# EAGLE design leo_joy_gamer_v2 (EAGLE 6.3)
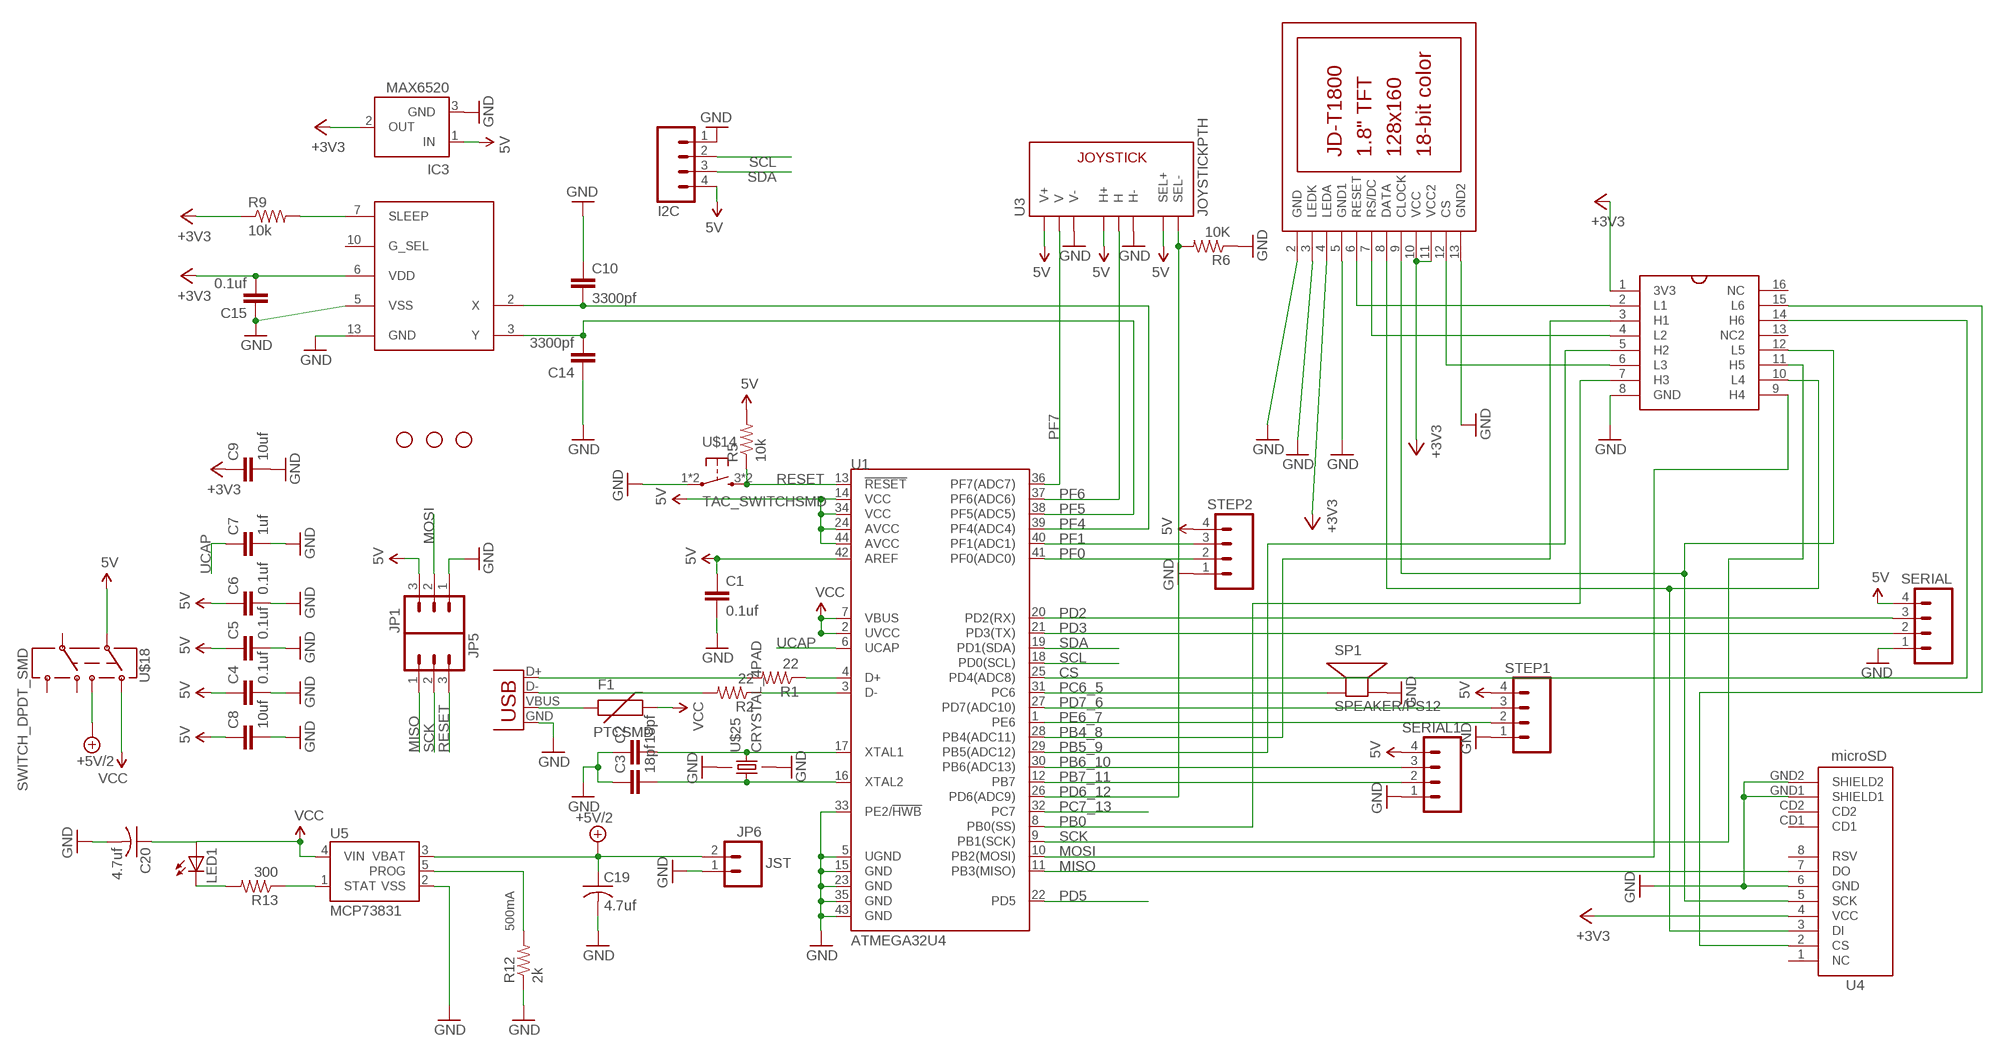
[diagram p0: schematic, sheet 1]

## Parts
C1  0.1uf  CAP0805  [0805]
C2  18pf  CAP0805  [0805]
C3  18pf  CAP0805  [0805]
C4  0.1uf  CAP0805  [0805]
C5  0.1uf  CAP0805  [0805]
C6  0.1uf  CAP0805  [0805]
C7  1uf  CAP0805  [0805]
C8  10uf  CAP0805  [0805]
C9  10uf  CAP0805  [0805]
C10  3300pf  CAP0805  [0805]
C14  3300pf  CAP0805  [0805]
C15  0.1uf  CAP0805  [0805]
C19  4.7uf  C-USC0603  [C0603]
C20  4.7uf  C-USC0603  [C0603]
F1  PTCSMD  [PTC-1206]
I2C  M04LOCK  [1X04_LOCK]
IC3  MAX6520  [SOT23]
JP1  M03LOCK  [1X03_LOCK]
JP2  STAND-OFF  [STAND-OFF]
JP3  STAND-OFF  [STAND-OFF]
JP4  STAND-OFF  [STAND-OFF]
JP5  M03LOCK  [1X03_LOCK]
JP6  JST  M02JST-PTH-2  [JST-2-PTH]
LCD1  JD-T1800  [JD-T1800]
LED1  LEDCHIPLED_1206  [CHIPLED_1206]
R1  22  R-US_M0805  [M0805]
R2  22  R-US_M0805  [M0805]
R5  10k  R-US_M0805  [M0805]
R6  10K  R-US_R0603  [R0603]
R9  10k  R-US_R0805  [R0805]
R12  2k  R-US_R0805  [R0805]
R13  300  R-US_R0805  [R0805]
SERIAL  M04LOCK  [1X04_LOCK]
SERIAL1  M04LOCK  [1X04_LOCK]
SP1  SPEAKER/PS12  [PS12]
STEP1  M04LOCK  [1X04_LOCK]
STEP2  M04LOCK  [1X04_LOCK]
U1  ATMEGA32U4  ATMEGA32U4QFN2  [QFN-44-NOPAD]
U3  JOYSTICKPTH  [JOYSTICK]
U4  microSD  USD-SOCKETSMD  [MICRO-SD-SOCKET-PP]
U5  MCP73831  [SOT23-5]
U$2  CD4050SO_16_MIDDLE  [SO_16]
U$12  ACCELEROMETER_MMA6331L  [LGA14]
U$14  TAC_SWITCHSMD  [TAC_SWITCH_SMD]
U$18  SWITCH_DPDT_SMD  [SWITCH_DPDT]
U$25  CRYSTAL_4PAD  [CRYSTAL_4PAD_TINY]
X1  USBSMD  [USB-MINIB]

## Nets
5V: C1.1 C4.1 C5.1 C6.1 C8.1 I2C.4 IC3.1(IN) JP1.3 R5.2 SERIAL1.4 SERIAL.4 STEP1.4 STEP2.4 U1.14(VCC) U1.24(AVCC) U1.34(VCC) U1.42(AREF) U1.44(AVCC) U3.B1A(SEL+) U3.H1(H+) U3.V1(V+) U$18.7
+3V3: C9.1 C15.2 IC3.2(OUT) LCD1.4(LEDA) LCD1.10(VCC) LCD1.11(VCC2) R9.1 U4.4(VCC) U$2.1(3V3) U$12.6(VDD)
+5V/2: C19.1 JP6.2 U5.3(VBAT) U$18.8
CS: U1.25(PD4(ADC8)) U$2.14(H6)
D+: R1.2 X1.D+
D-: R2.2 X1.D-
GND: C1.2 C2.1 C3.1 C4.2 C5.2 C6.2 C7.2 C8.2 C9.2 C10.1 C14.1 C15.1 C19.2 C20.2 I2C.1 IC3.3(GND) JP1.1 JP6.1 LCD1.2(GND) LCD1.3(LEDK) LCD1.5(GND1) LCD1.13(GND2) R6.1 R12.1 SERIAL1.1 SERIAL.1 SP1.P$2(-) STEP1.1 STEP2.1 U1.5(UGND) U1.15(GND) U1.23(GND) U1.33(PE2/!HWB) U1.35(GND) U1.43(GND) U3.H3(H-) U3.V3(V-) U4.6(GND) U4.GND1(SHIELD1) U4.GND2(SHIELD2) U5.2(VSS) U$2.8(GND) U$12.5(VSS) U$12.13(GND) U$14.1 U$14.2 U$25.2(GND2) U$25.4(GND4) X1.GND
MISO: JP5.1 U1.11(PB3(MISO)) U4.7(DO)
MOSI: JP1.2 U1.10(PB2(MOSI)) U$2.9(H4)
MOSI_3V3: LCD1.8(DATA) U4.3(DI) U$2.10(L4)
N$1: LCD1.6(RESET) U$2.2(L1)
N$2: C2.2 U1.17(XTAL1) U$25.3
N$3: C3.2 U1.16(XTAL2) U$25.1
N$4: LCD1.7(RS/DC) U$2.4(L2)
N$5: LCD1.12(CS) U$2.6(L3)
N$6: R1.1 U1.4(D+)
N$7: U4.2(CS) U$2.15(L6)
N$8: R2.1 U1.3(D-)
N$10: R9.2 U$12.7(SLEEP)
N$13: R13.1 U5.1(STAT)
N$14: LED1.C R13.2
PB0: U1.8(PB0(SS)) U$2.7(H3)
PB4_8: U1.28(PB4(ADC11)) U$2.3(H1)
PB5_9: U1.29(PB5(ADC12)) U$2.5(H2)
PB6_10: SERIAL1.3 U1.30(PB6(ADC13))
PB7_11: SERIAL1.2 U1.12(PB7)
PC6_5: SP1.P$1(+) U1.31(PC6)
PC7_13: U1.32(PC7)
PD2: SERIAL.3 U1.20(PD2(RX))
PD3: SERIAL.2 U1.21(PD3(TX))
PD5: U1.22(PD5)
PD6_12: R6.2 U1.26(PD6(ADC9)) U3.B2A(SEL-)
PD7_6: STEP1.3 U1.27(PD7(ADC10))
PE6_7: STEP1.2 U1.1(PE6)
PF0: STEP2.2 U1.41(PF0(ADC0))
PF1: STEP2.3 U1.40(PF1(ADC1))
PF4: C10.2 U1.39(PF4(ADC4)) U$12.2(X)
PF5: C14.2 U1.38(PF5(ADC5)) U$12.3(Y)
PF6: U1.37(PF6(ADC6)) U3.H2(H)
PF7: U1.36(PF7(ADC7)) U3.V2(V)
PROG: R12.2 U5.5(PROG)
RESET: JP5.3 R5.1 U1.13(!RESET) U$14.3 U$14.4
SCK: JP5.2 U1.9(PB1(SCK)) U$2.11(H5)
SCK_3V3: LCD1.9(CLOCK) U4.5(SCK) U$2.12(L5)
SCL: I2C.2 U1.18(PD0(SCL))
SDA: I2C.3 U1.19(PD1(SDA))
UCAP: C7.1 U1.6(UCAP)
VBUS: F1.1 X1.VBUS
VCC: C20.1 F1.2 LED1.A U1.2(UVCC) U1.7(VBUS) U5.4(VIN) U$18.1
Unconnected: U4.1(NC) U4.8(RSV) U4.CD1 U4.CD2 U$2.13(NC2) U$2.16(NC) U$12.10(G_SEL) U$18.9 U$18.10 U$18.11

## Notes on the sheet
- 500mA

## Library data of the parts
C1-C10 C14 C15 = SparkFun:CAP: Capacitor Standard 0603 ceramic capacitor, and 0.1" leaded capacitor.
C19 C20 = resistor:C-US: CAPACITOR, American symbol
F1 = SparkFun:PTC: Resettable Fuse PTC Resettable Fuse. Spark Fun Electronics SKU : COM-08357
I2C SERIAL SERIAL1 STEP1 STEP2 = SparkFun:M04: Header 4 Standard 4-pin 0.1" header. Use with straight break away headers (SKU : PRT-00116), right angle break away headers (PRT-00553), swiss pins (PRT-00743), machine pins (PRT-00117), and female headers (PRT-00115). Molex polarized connector foot print use with SKU : PRT-08231 with associated crimp pins and housings. 1MM SMD Version SKU: PRT-10208
IC3 = maxim:MAX6520: 1.2V Voltage Reference 50ppm/°C, SOT23, 3-Terminal Source: http://datasheets.maxim-ic.com/en/ds/MAX6520.pdf
JP1 JP5 = SparkFun:M03: Header 3 Standard 3-pin 0.1" header. Use with straight break away headers (SKU : PRT-00116), right angle break away headers (PRT-00553), swiss pins (PRT-00743), machine pins (PRT-00117), and female headers (PRT-00115). Molex polarized connector foot print use with SKU : PRT-08232 with associated crimp pins and housings.
JP2-JP4 = SparkFun:STAND-OFF: Stand Off This is the mechanical footprint for a #4 phillips button head screw. Use the keepout ring to avoid running the screw head into surrounding components. SKU : PRT-00447
JP6 = SparkFun:M02: Header 2 Standard 2-pin 0.1" header. Use with straight break away headers (SKU : PRT-00116), right angle break away headers (PRT-00553), swiss pins (PRT-00743), machine pins (PRT-00117), and female headers (PRT-00115). Molex polarized connector foot print use with SKU : PRT-08233 with associated crimp pins and housings.
LCD1 = adafruit:JD-T1800
LED1 = adafruit:LED: LED OSRAM: - CHIPLED LG R971, LG N971, LY N971, LG Q971, LY Q971, LO R971, LY R971 LH N974, LH R974 LS Q976, LO Q976, LY Q976 LO Q996 - Hyper CHIPLED LW Q18S LB Q993, LB Q99A, LB R99A - SideLED LS A670, LO A670, LY A670, LG A670, LP A670 LB A673, LV A673, LT A673, LW A673 LH A674 LY A675 LS A676, LA A676, LO A676, LY A676, LW A676 LS A679, LY A679, LG A679 - Hyper Micro SIDELED® LS Y876, LA Y876, LO Y876, LY Y876 LT Y87S - SmartLED LW L88C, LW L88S LB L89C, LB L89S, LG L890 LS L89K, LO L89K, LY L89K LS L896, LA L896, LO L896, LY L896 - TOPLED LS T670, LO T670, LY T670, LG T670, LP T670 LSG T670, LSP T670, LSY T670, LOP T670, LYG T670 LG T671, LOG T671, LSG T671 LB T673, LV T673, LT T673, LW T673 LH T674 LS T676, LA T676, LO T676, LY T676, LB T676, LH T676, LSB T676, LW T676 LB T67C, LV T67C, LT T67C, LS T67K, LO T67K, LY T67K, LW E67C LS E67B, LA E67B, LO E67B, LY E67B, LB E67C, LV E67C, LT E67C LW T67C LS T679, LY T679, LG T679 LS T770, LO T770, LY T770, LG T770, LP T770 LB T773, LV T773, LT T773, LW T773 LH T774 LS E675, LA E675, LY E675, LS T675 LS T776, LA T776, LO T776, LY T776, LB T776 LHGB T686 LT T68C, LB T68C - Hyper Mini TOPLED® LB M676 - Mini TOPLED Santana® LG M470 LS M47K, LO M47K, LY M47K Source: http://www.osram.convergy.de/
R1 R2 R5 R6 R9 R12 R13 = resistor:R-US_: RESISTOR, American symbol
SP1 = adafruit:SPEAKER: SPEAKER Source: Buerklin Added PS12 (for part # PS1240 piezo) http://www.ladyada.net/library/pcb/eaglelibrary.html
U1 = SparkFun:ATMEGA32U4
U3 = SparkFun:JOYSTICK: Thumb Joystick Joystick commonly found in PS2 controllers. Two pots and a select switch. Footprint proven. Spark Fun Electronics SKU : COM-09032
U4 = SparkFun:USD-SOCKET: microSD Socket Push-push type uSD socket. Schematic element and footprint production proven. Spark Fun Electronics SKU : PRT-00127. tDoc lines correctly indicate media card edge positions when inserting (unlocked, locked, depressed).
U5 = SparkFun:MCP73831: Microchip's MCP73831 Miniature single cell, fully integrated Li-Ion, Li-polymer charge management controller http://ww1.microchip.com/downloads/en/DeviceDoc/21984a.pdf
U$2 = sam:CD4050
U$12 = sam:ACCELEROMETER_MMA6331L
U$14 = sam:TAC_SWITCH
U$18 = sam:SWITCH_DPDT_SMD
U$25 = sam:CRYSTAL_4PAD
X1 = SparkFun:USB: USB Connectors USB-B-PTH is fully proven SKU : PRT-00139 USB-miniB is fully proven SKU : PRT-00587 USB-A-PCB is untested. USB-A-H is throughly reviewed, but untested. Spark Fun Electronics SKU : PRT-00437 USB-B-SMT is throughly reviewed, but untested. Needs silkscreen touching up. USB-A-S has not been used/tested USB-MB-H has not been used/tested

## Board
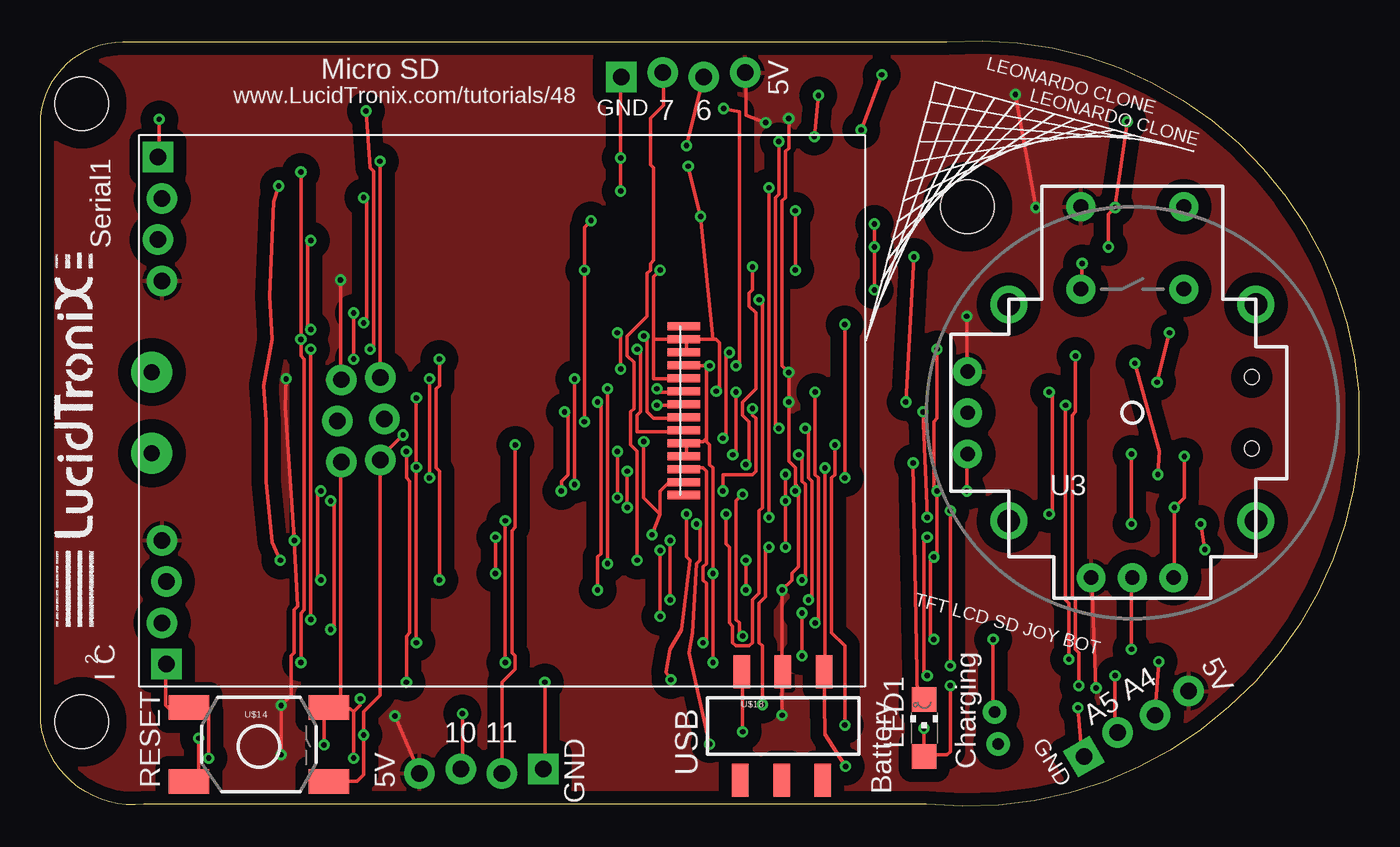
[diagram p1: board, top side]
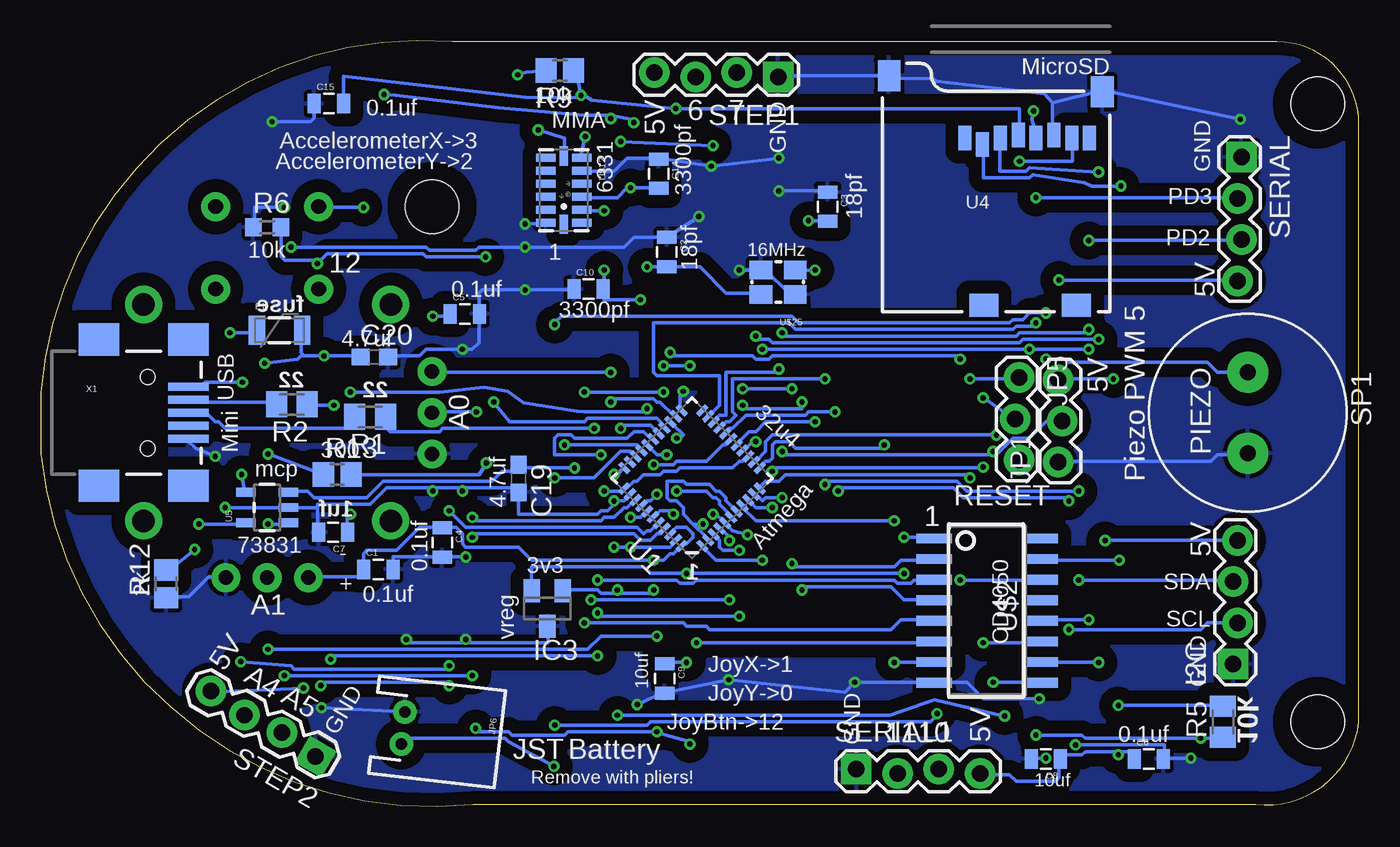
[diagram p2: board, bottom side, seen from below]

Size 81.28 x 47.2 mm. Coordinates in mm from the lower left corner, seen from the top.
Outline: 6.35,0.13 arc-90 0,5.21 0,42.04 arc-90 5.08,47.12 55.88,47.12 arc-90 81.28,25.53 81.28,21.72 arc-90 54.61,0.13 6.35,0.13
Copper layers (1*16): Top 0.0356mm / dielectric 1.5011mm / Bottom 0.0356mm
Design rules "LaenPCBOrder *": minimum track width 8mil, minimum drill 13mil, track to track 6mil, track to pad 6mil, pad to pad 6mil, via to via 6mil, smd to smd 6mil, copper to edge 15mil, drill to drill 6mil, minimum pad ring 7mil, minimum via ring 7mil, stop-mask expansion 4mil, vias tented up to drill 26mil, thermal gap 10mil

### Footprints (pad centres in the part's own frame; a part is rotated, then mirrored left to right if it is on the bottom)
0805 = smd 0.8 x 1.2: 1 -0.9,0; 2 0.9,0
C0603 = smd 1.1 x 1: 1 -0.85,0; 2 0.85,0
PTC-1206 = smd 1 x 1.8: 1 -1.4,0; 2 1.4,0
1X04_LOCK = drill 1.016 pad 1.88 square: 1 0,0.127 | drill 1.016 pad 1.88: 2 2.54,-0.127; 3 5.08,0.127; 4 7.62,-0.127
SOT23 = smd 1 x 1.4: 1 -0.95,-1.1; 2 0.95,-1.1; 3 0,1.1
1X03_LOCK = drill 1.016 pad 1.88: 1 0,0.127; 2 2.54,-0.127; 3 5.08,0.127
STAND-OFF = hole 3.302: 0,0
JST-2-PTH = drill 0.7 pad 1.448: 1 -1,0; 2 1,0
JD-T1800 = smd 0.5 x 2: 1 5.2,-13.1; 2 4.4,-13.1; 3 3.6,-13.1; 4 2.8,-13.1; 5 2,-13.1; 6 1.2,-13.1; 7 0.4,-13.1; 8 -0.4,-13.1; 9 -1.2,-13.1; 10 -2,-13.1; 11 -2.8,-13.1; 12 -3.6,-13.1; 13 -4.4,-13.1; 14 -5.2,-13.1
CHIPLED_1206 = smd 1.5 x 1.5: A 0,-1.75; C 0,1.75
M0805 = smd 1.3 x 1.6: 1 -0.95,0; 2 0.95,0
R0603 = smd 1 x 1.1: 1 -0.85,0; 2 0.85,0
R0805 = smd 1.3 x 1.5: 1 -0.85,0; 2 0.85,0
PS12 = drill 1 pad 2.54: P$1 -2.5,0; P$2 2.5,0
QFN-44-NOPAD = smd 0.8 x 0.3: 1 -3.4,2.5; 2 -3.4,2; 3 -3.4,1.5; 4 -3.4,1; 5 -3.4,0.5; 6 -3.4,0; 7 -3.4,-0.5; 8 -3.4,-1; 9 -3.4,-1.5; 10 -3.4,-2; 11 -3.4,-2.5; 23 3.4,-2.5; 24 3.4,-2; 25 3.4,-1.5; 26 3.4,-1; 27 3.4,-0.5; 28 3.4,0; 29 3.4,0.5; 30 3.4,1; 31 3.4,1.5; 32 3.4,2; 33 3.4,2.5 | smd 0.3 x 0.8: 12 -2.5,-3.4; 13 -2,-3.4; 14 -1.5,-3.4; 15 -1,-3.4; 16 -0.5,-3.4; 17 0,-3.4; 18 0.5,-3.4; 19 1,-3.4; 20 1.5,-3.4; 21 2,-3.4; 22 2.5,-3.4; 34 2.5,3.4; 35 2,3.4; 36 1.5,3.4; 37 1,3.4; 38 0.5,3.4; 39 0,3.4; 40 -0.5,3.4; 41 -1,3.4; 42 -1.5,3.4; 43 -2,3.4; 44 -2.5,3.4
JOYSTICK = drill 0.9 pad 1.778: B1A -3.175,12.7; B1B 3.175,12.7; B2A -3.175,7.62; B2B 3.175,7.62 | drill 0.889 pad 1.778: H1 -2.54,-10.16; H2 0,-10.16; H3 2.54,-10.16; V1 -10.16,2.54; V2 -10.16,0; V3 -10.16,-2.54 | drill 1.397 pad 2.286: MOUNT1 -7.62,6.668; MOUNT2 -7.62,-6.668; MOUNT3 7.62,-6.668; MOUNT4 7.62,6.668
MICRO-SD-SOCKET-PP = smd 0.8 x 1.5: 1 -8.94,10.7; 2 -7.84,10.3; 3 -6.74,10.7; 4 -5.64,10.9; 5 -4.54,10.7; 6 -3.44,10.9; 7 -2.34,10.7; 8 -1.24,10.7 | smd 1.8 x 1.4: CD1 -7.75,0.4; CD2 -2.05,0.4 | smd 1.4 x 1.9: GND1 -13.6,14.55; GND2 -0.45,13.55
SOT23-5 = smd 0.55 x 1.2: 1 -0.95,-1.3; 2 0,-1.3; 3 0.95,-1.3; 4 0.95,1.3; 5 -0.95,1.3
SO_16 = smd 0.6 x 2.2: 1 -4.445,-3.457; 2 -3.175,-3.457; 3 -1.905,-3.457; 4 -0.635,-3.457; 5 0.635,-3.457; 6 1.905,-3.457; 7 3.175,-3.457; 8 4.445,-3.457; 9 4.445,3.076; 10 3.175,3.076; 11 1.905,3.076; 12 0.635,3.076; 13 -0.635,3.076; 14 -1.905,3.076; 15 -3.175,3.076; 16 -4.445,3.076
LGA14 = smd 0.5 x 1.2: 1 2,1.1; 2 1.2,1.1; 3 0.4,1.1; 4 -0.4,1.1; 5 -1.2,1.1; 6 -2,1.1; 8 -2,-1.1; 9 -1.2,-1.1; 10 -0.4,-1.1; 11 0.4,-1.1; 12 1.2,-1.1; 13 2,-1.1 | smd 1.2 x 0.5: 7 -2.1,0; 14 2.1,0
TAC_SWITCH_SMD = smd 2.5 x 1.5: 1 -4.302,2.397; 2 4.302,2.397; 3 -4.302,-2.143; 4 4.302,-2.143
SWITCH_DPDT = smd 1.016 x 2.032: 1 -2.5,3.333; 7 0.04,3.333; 8 2.58,3.333; 9 -2.58,-3.333; 10 -0.04,-3.333; 11 2.5,-3.333
CRYSTAL_4PAD_TINY = smd 1.4 x 1.15: 1 0.724,0.602; 2 2.824,0.602; 3 2.824,2.102; 4 0.724,2.102
USB-MINIB = smd 2.5 x 0.5: D+ 2.5,0; D- 2.5,0.8; GND 2.5,-1.6; ID 2.5,-0.8; VBUS 2.5,1.6 | smd 2.5 x 2: MTN1 -3,4.5; MTN2 2.5,4.5; MTN3 -3,-4.5; MTN4 2.5,-4.5 | hole 0.9: 0,2.2; 0,-2.2

### Placement (x,y rotation side)
C1  60.45,14.61 0 bottom
C2  42.67,34.17 270 bottom
C3  32.77,36.96 270 bottom
C4  56.52,16.26 270 bottom
C5  55.12,30.36 0 bottom
C6  12.95,2.93 0 bottom
C7  63.25,16.9 180 bottom
C8  19.3,2.93 180 bottom
C9  42.8,7.88 270 bottom
C10  47.5,31.88 0 bottom
C14  43.18,38.99 270 bottom
C15  63.5,43.31 0 bottom
C19  51.82,20.2 270 bottom
C20  60.71,27.69 0 bottom
F1  66.55,29.34 0 bottom
I2C  7.62,8.77 90 bottom
IC3  50.04,12.2 180 bottom
JP1  18.41,21.21 90 bottom
JP2  2.54,5.21 0 top
JP3  57.15,36.96 0 top
JP4  2.54,43.31 0 top
JP5  21.08,26.42 270 bottom
JP6  58.93,4.83 263.4 bottom
LCD1  26.54,24.39 90 top
LED1  54.48,4.83 0 top
R1  60.96,24.01 180 bottom
R2  65.79,24.77 180 bottom
R5  8.38,5.21 90 bottom
R6  67.31,35.69 0 bottom
R9  49.28,45.34 180 bottom
R12  73.53,13.72 90 bottom
R13  62.99,20.45 0 bottom
SERIAL  7.37,40.01 270 bottom
SERIAL1  30.99,2.16 0 bottom
SP1  6.86,24.26 270 bottom
STEP1  35.81,45.09 180 bottom
STEP2  64.26,3.18 149.9 bottom
U1  41.12,20.23 135 bottom
U3  67.31,24.26 0 top
U4  15.37,30.48 0 bottom
U5  67.31,18.42 90 bottom
U$2  22.73,12.07 270 bottom
U$6  [LUCIDTRONIX_LOGO_.75_INCH]  3.81,10.55 90 top
U$12  49.02,37.98 270 bottom
U$14  13.46,3.69 0 top
U$18  45.72,4.96 0 top
U$25  34.04,33.66 180 bottom
X1  74.68,24.26 0 bottom

### Tracks (layer width: path | path; a pad name or v marks a point on that pad's centre or on a via)
5V  (via drill 0.33)
  Top 0.203: v14.83,3.18 v14.83,6.23 15.44,6.84 15.44,9.28 15.65,9.48 15.65,12.12 15.85,12.32 15.6,17 | v15.65,16.39 15.65,16.79 15.6,17 | 15.6,17 15.09,24.62 v15.14,26.34 | v18.49,32.44 18.49,26.34 JP1.3 | v44.7,42.14 43.48,42.6 43.48,45.04 STEP1.4 | v61.37,36.91 v60.1,43.87 | v65.08,7.29 64.82,13.95 U3.H1 | v43.48,13.34 v43.48,15.17 | v57.1,30.21 57.1,26.95 U3.V1 | v46.53,19.44 46.53,19.84 | 46.53,19.84 46.53,20.86 46.13,21.26 v46.13,24.92 v46.13,26.75 45.72,27.16 45.72,37.32 45.92,37.52 45.92,40.37 46.13,40.57 v46.13,42.4 | 46.53,19.84 46.74,19.64 46.74,14.76 46.33,14.36 46.33,13.95 v45.72,13.34 45.72,8.46 U$18.7 45.72,8.26 v45.72,5.62 | v21.84,5.57 SERIAL1.4
  Bottom 0.203: 14.83,3.38 16.87,3.38 17.07,3.18 18.49,3.18 18.49,2.98 C8.1 18.49,2.77 18.49,1.76 18.69,1.55 21.13,1.55 21.54,1.96 23.37,1.96 SERIAL1.4 | 14.83,3.38 13.82,3.38 13.82,2.98 C6.1 | v14.83,6.23 8.53,6.23 R5.2 | 14.83,3.38 v14.83,3.18 | v15.65,16.39 I2C.4 | v15.14,26.34 18.49,26.34 JP1.3 | v18.49,32.44 7.52,32.44 SERIAL.4 | v44.7,42.14 44.91,42.35 46.13,42.6 | 46.13,42.6 47.75,42.6 53.03,43.06 59.38,43.82 v60.1,43.87 | v61.37,36.91 64.01,36.91 U3.B1A | U3.H1 64.62,14.15 61.37,14.15 61.37,14.56 C1.1 61.37,14.76 61.37,15.57 61.16,15.78 59.33,15.78 57.91,17.2 56.69,17.2 C4.1 56.49,17.2 55.68,17.2 55.27,16.79 55.27,16.18 55.07,15.98 51.82,15.98 51,15.17 v43.48,15.17 42.88,15.17 42.47,15.57 42.27,15.57 41.86,15.98 U1.44 41.66,16.18 41.45,16.18 41.05,16.59 41.05,16.79 41.45,17.2 42.06,17.2 42.47,16.79 U1.42 | v65.08,7.29 70.71,7.04 STEP2.4 | v43.48,13.34 43.69,13.14 45.72,13.14 | 45.72,13.14 46.74,13.14 46.94,13.34 48.97,13.34 IC3.1 | 45.72,13.14 v45.72,13.34 | v57.1,30.21 56.08,30.21 C5.1 | U1.14 37.8,21.47 38,21.26 38.2,21.26 38.61,20.86 41.86,20.86 42.06,20.65 42.88,20.65 43.08,20.45 44.09,20.45 44.5,20.05 44.7,20.05 45.11,19.64 U1.34 45.31,19.44 v46.53,19.44 | v46.13,24.92 45.92,25.13 43.48,25.13 43.28,24.92 43.08,24.92 42.27,24.11 U1.24 | v46.13,26.75 57.1,26.75 U3.V1 | v46.13,42.4 46.13,42.6 | v21.84,5.57 26.16,6.58 28.91,5.62 v45.72,5.62
  pour Top (isolate 0.813): -6.86,-9.27 0,55.5 86.61,54.49 79.76,-9.27
+3V3  (via drill 0.33)
  Top 0.203: LCD1.11 39.83,21.67 39.83,22.28 LCD1.10 39.83,22.48 40.84,22.48 41.05,22.69 | 41.05,27.16 39.83,27.16 LCD1.4 | 41.05,22.69 41.05,27.16 | v41.45,8.87 v41.45,14.36 41.45,20.86 41.25,21.06 41.25,22.28 41.05,22.48 41.05,22.69 | v28.04,14.36 v28.04,16.59 | v47.95,43.82 v47.7,41.28 | v41.25,27.16 41.05,27.16 | v42.88,27.16 43.08,27.36 43.08,42.8 v42.11,43.01
  Bottom 0.203: v41.45,8.87 42.67,8.87 C9.1 | IC3.2 51,13.34 51,14.76 44.09,14.76 43.69,14.36 v41.45,14.36 v28.04,14.36 | v28.04,16.59 26.21,16.59 U$2.1 | v47.7,41.28 47.95,40.16 U$12.6 | R9.1 48.21,44.99 v47.95,43.82 47.95,43.62 48.16,43.67 | 48.16,43.67 51.41,43.72 62.59,44.99 C15.2 | 48.16,43.67 47.95,43.92 47.3,43.51 v42.11,43.01 20.93,43.01 20.93,41.58 U4.4 | v42.88,27.16 v41.25,27.16
+5V/2  (via drill 0.33)
  Top 0.203: v48.36,20.86 48.36,8.46 U$18.8 48.36,4.45 v49.63,2.47
  Bottom 0.203: v48.36,20.86 51.61,20.86 | 51.61,20.86 51.82,20.86 C19.1 51.61,20.86 | 51.61,20.86 51.82,20.65 52.83,20.65 53.44,20.05 60.15,20.05 61.16,19.03 64.41,19.03 64.82,19.44 65.84,19.44 U5.3 | v49.63,2.47 52.43,3.99 52.63,4.2 58.73,4.2 58.93,3.99 JP6.2
CS  (via drill 0.33)
  Top 0.203: v42.06,22.69 42.27,22.89 42.27,27.77 v42.47,27.97 | v24.59,27.56 24.59,25.94 24.38,25.73 24.38,20.86 24.59,20.65 v24.59,13.95
  Bottom 0.203: v42.06,22.69 41.86,22.69 41.66,22.89 42.27,23.5 U1.25 | v42.47,27.97 42.27,27.77 37.39,27.77 37.19,27.56 36.37,27.56 36.17,27.77 24.79,27.77 v24.59,27.56 | v24.59,13.95 19.71,13.95 U$2.14
D+
  Bottom 0.203: R1.2 61.98,23.91 61.98,23.3 69.9,23.3 70.31,23.7 70.51,23.7 71.12,24.31 72.14,24.31 X1.D+
D-
  Bottom 0.203: R2.2 66.85,24.92 72.14,24.92 X1.D-
GND  (via drill 0.33)
  Top 0.203: v67,42.19 v66.24,36.91 65.84,36.5 v65.84,34.47 | v51.41,31.83 v51.41,34.47 v51.41,35.89 | v41.66,25.58 41.86,25.53 41.86,28.58 41.66,28.78 41.45,28.78 | 39.83,28.78 41.45,28.78 | 41.45,28.78 v40.69,36.35 v39.93,39.45 | 37.8,28.78 37.8,26.34 39.62,26.34 LCD1.5 | 37.8,28.78 39.62,28.78 LCD1.2 39.83,28.78 | 39.83,28.78 39.83,28.17 LCD1.3 | v38.2,33.05 37.8,32.64 37.8,28.78 | v35.76,37.93 v35.76,39.96 35.76,44.84 STEP1.1 | v7.32,42.35 7.32,40.16 SERIAL.1 | v55.07,10.29 54.86,10.49 54.86,15.17 v55.07,15.37 55.27,15.57 v55.27,19.44 55.07,19.64 55.07,23.7 55.27,23.91 v55.27,28.17 | v58.73,10.29 58.73,6.02 JP6.1 | v63.96,6.08 64.21,3.18 STEP2.1 | 19.3,5.82 v19.3,2.98 | 19.3,5.82 19.1,6.02 18.49,6.02 | 18.49,6.02 17.88,6.02 U$14.2 | v10.36,2.98 10.36,5.82 10.16,6.02 9.35,6.02 U$14.1 9.14,6.02 7.92,6.02 7.72,6.23 7.72,8.67 I2C.1 | v17.48,3.79 17.48,6.02 17.68,6.02 U$14.2 | U3.H3 69.9,14.15 v69.9,18.42 70.51,19.03 v70.51,21.57 | v31.09,7.65 31.09,2.37 SERIAL1.1 | v57.1,19.44 57.1,21.67 U3.V3 | 38.2,18.01 38.2,19.44 38.81,20.05 39.62,20.05 LCD1.13 | 38.2,18.01 v37.69,16.74 | v37.19,22.48 37.19,19.03 38.2,18.01 | v45.92,15.98 v45.92,18.83 v45.92,20.45 | v44.5,6.28 44.5,9.89 44.3,10.09 44.3,12.53 44.7,12.93 44.7,15.78 v44.91,15.98 | v39.83,18.01 39.83,15.37 40.03,15.17 39.52,10.9 38.81,9.68 38.56,8.26 v38.86,7.8 | 19.3,5.82 19.71,6.23 v19.71,6.63 | 18.49,6.02 18.49,21.06 JP1.1 | 18.49,6.02 U$14.2
  Bottom 0.203: v66.24,36.91 68.07,36.91 68.07,35.69 R6.1 | v67,42.19 64.62,42.19 64.41,42.4 64.41,43.21 C15.1 | C20.2 59.74,27.77 57.91,27.77 57.51,28.17 v55.27,28.17 54.66,28.17 54.25,28.58 54.25,30.21 C5.2 54.25,30.41 54.25,31.63 54.05,31.83 v51.41,31.83 48.56,31.83 C10.1 | v51.41,35.89 50.19,35.89 U$12.13 | v65.84,34.47 57.51,34.47 57.3,34.27 54.46,34.27 54.25,34.47 v51.41,34.47 45.31,34.47 44.7,35.08 C2.1 | U$12.5 47.75,39.15 45.92,39.15 45.11,39.96 43.28,39.96 C14.1 43.08,39.96 v39.93,39.45 v35.76,39.96 | U$25.4 34.95,31.63 35.15,31.63 36.58,33.05 36.78,33.05 U$25.2 36.98,33.05 v38.2,33.05 | v41.66,25.58 41.86,25.33 41.86,24.52 U1.23 | v40.69,36.35 C2.1 | 18.9,43.36 18.9,41.58 U4.6 | 15.8,44.12 18.9,43.36 | 15.8,44.12 15.85,44.07 15.85,44.02 U4.GND2 | v35.76,37.93 32.92,37.93 C3.1 | STEP1.1 35.76,45.04 29.06,45.04 U4.GND1 29.06,44.84 26.26,44.89 26.06,44.68 19.41,43.92 18.9,43.36 | 15.8,44.12 v7.32,42.35 | C2.1 | 49.99,11.1 IC3.3 49.99,10.9 49.99,10.09 54.86,10.09 | C1.2 59.54,14.76 59.54,15.37 56.69,15.37 C4.2 56.49,15.37 v55.07,15.37 | v58.73,10.29 58.52,10.09 54.86,10.09 | 54.86,10.09 v55.07,10.29 | v63.96,6.08 58.93,5.82 JP6.1 | JP1.1 18.49,21.26 9.14,21.26 8.74,21.67 6.91,21.67 SP1.P$2 | v19.3,2.98 20.12,2.98 C8.2 | v10.36,2.98 11.99,2.98 | v17.48,3.79 11.99,3.79 11.99,2.98 | 11.99,2.98 C6.2 | 64.21,18.42 64.21,17 C7.2 | 64.21,18.42 U5.2 v69.9,18.42 | R12.1 73.36,12.93 72.14,12.93 70.92,14.15 69.9,14.15 U3.H3 | v70.51,21.57 71.73,22.08 72.14,22.48 X1.GND | 55.27,19.64 51.82,19.64 C19.2 51.82,18.01 46.94,18.01 46.74,18.22 46.33,18.22 45.72,18.83 | 55.27,19.64 56.9,19.64 | v37.69,16.74 38.61,17 39.01,17.4 U1.5 39.22,17.61 39.62,18.01 v39.83,18.01
  Bottom 0.203: v37.19,22.48 37.39,22.48 38,21.87 U1.15 | v45.92,15.98 v44.91,15.98 42.47,15.98 42.06,16.39 U1.43 | 45.72,18.83 45.31,18.83 44.91,19.23 U1.35 | v45.92,20.45 45.72,20.45 45.31,20.86 U1.33 | v44.5,6.28 42.88,7.04 C9.2 42.67,7.04 v38.86,7.8 31.7,7.04 v31.09,7.65 26.21,7.65 U$2.8 26.01,7.65 24.18,7.65 23.16,6.63 v19.71,6.63 | 45.72,18.83 v45.92,18.83 | 64.21,18.42 64.21,18.62 60.96,18.62 59.94,19.64 56.9,19.64 | 56.9,19.64 v57.1,19.44 | 55.27,19.64 v55.27,19.44
  pour Bottom (isolate 0.813): -0.76,56.14 -4.06,-10.79 83.57,-12.06 87.12,55.63
MISO  (via drill 0.33)
  Top 0.203: v23.98,26.34 v23.98,20.25 | v20.93,39.76 20.93,26.55 JP5.1
  Bottom 0.203: v23.98,20.25 24.18,20.45 35.36,20.45 35.76,20.05 36.58,20.05 36.98,19.64 U1.11 | v23.98,26.34 21.13,26.34 JP5.1 | v20.93,39.76 17.68,39.76 17.68,41.18 U4.7
MOSI  (via drill 0.33)
  Top 0.203: v35.56,21.87 v35.56,19.03 | v22.55,7.65 22.55,10.49 22.76,10.7 22.76,20.05 22.55,20.25 v22.55,21.87
  Bottom 0.203: v35.56,19.03 36.58,19.03 36.78,18.83 37.19,19.23 U1.10 | v35.56,21.87 35.36,21.67 22.35,21.67 22.15,21.87 | 22.15,21.87 21.34,22.69 20.32,22.69 19.3,23.7 18.29,23.7 JP1.2 | v22.55,7.65 19.71,7.65 U$2.9 | 22.15,21.87 v22.55,21.87
MOSI_3V3  (via drill 0.33)
  Top 0.203: v16.05,39.1 v16.05,28.78 16.05,27.77 16.26,27.56 16.26,12.12 16.05,11.92 v16.05,8.87 | v37.19,28.99 37.39,28.78 37.39,24.31 37.8,23.91 39.62,23.91 LCD1.8
  Bottom 0.203: v16.05,39.1 20.32,39.35 20.52,39.15 22.15,39.15 22.15,41.18 U4.3 | v16.05,8.87 19.51,8.87 U$2.10 | v37.19,28.99 36.98,28.78 36.37,28.78 36.17,28.58 20.93,28.58 20.73,28.78 v16.05,28.78
N$1  (via drill 0.33)
  Top 0.203: v38,25.73 38.2,25.53 39.62,25.53 LCD1.6 | v34.95,14.97 v34.95,25.73
  Bottom 0.203: v34.95,25.73 v38,25.73 | v34.95,14.97 34.75,14.76 28.65,14.76 28.25,15.17 26.21,15.17 U$2.2
N$2  (via drill 0.33)
  Top 0.203: v43.48,21.06 43.69,21.26 43.69,23.7 43.28,24.11 43.28,24.92 44.09,25.73 44.09,30.41 43.69,30.81 43.69,31.63 43.89,31.83 v43.89,33.25
  Bottom 0.203: 42.67,33.25 40.64,33.25 39.01,31.63 36.98,31.63 U$25.3 | v43.48,21.06 42.27,21.06 42.06,21.26 40.23,21.26 39.22,22.28 39.01,22.28 38.81,22.48 U1.17 | 42.67,33.25 v43.89,33.25 | 42.67,33.25 C2.2
N$3  (via drill 0.33)
  Top 0.203: v33.93,36.1 33.53,35.69 v33.53,33.05 v33.53,23.7
  Bottom 0.203: v33.93,36.1 32.92,36.1 C3.2 | v33.53,33.05 34.75,33.05 U$25.1 | v33.53,23.7 36.58,23.7 37.19,23.09 37.59,23.09 38.41,22.28 U1.16
N$4  (via drill 0.33)
  Top 0.203: v34.34,13.34 34.34,15.37 34.54,15.57 34.54,24.72 v34.34,24.92 | v38,24.72 39.62,24.72 LCD1.7
  Bottom 0.203: v34.34,13.34 34.14,13.54 28.85,13.54 28.04,12.73 26.21,12.73 U$2.4 | v34.34,24.92 34.34,24.52 37.8,24.52 v38,24.72
N$5  (via drill 0.33)
  Top 0.203: v40.84,10.09 41.05,10.29 41.05,13.75 40.84,13.95 40.84,14.76 41.05,14.97 41.05,20.65 40.84,20.86 39.83,20.86 LCD1.12
  Bottom 0.203: v40.84,10.09 26.21,10.09 U$2.6
N$6  (via drill 0.33)
  Top 0.203: v38.81,12.73 v38.81,16.39 | v47.35,12.73 47.55,12.93 47.55,20.05 47.35,20.25 47.35,23.09 v47.14,23.3
  Bottom 0.203: v38.81,16.39 38.81,16.59 39.22,17 U1.4 | v47.35,12.73 v38.81,12.73 | v47.14,23.3 56.49,23.3 56.69,23.09 59.74,23.09 59.94,23.3 59.94,23.91 R1.1
N$7  (via drill 0.33)
  Top 0.203: v14.68,38.23 14.38,37.27 14.12,31.42 14.28,28.78 13.77,25.94 13.92,23.75 13.92,19.99 14.28,16.29 v14.78,15.17
  Bottom 0.203: v14.68,38.23 16.46,38.23 16.92,38.43 20.12,38.94 20.32,38.74 23.16,38.74 23.16,40.77 U4.2 | v14.78,15.17 19.51,15.17 U$2.15
N$8  (via drill 0.33)
  Top 0.203: v63.2,24.72 63.2,12.73 63.4,12.53 v63.4,9.07 | v46.94,11.92 v46.94,9.28 | v38.2,15.78 v38.2,11.71
  Bottom 0.203: v63.2,24.72 64.82,24.72 R2.1 | v63.4,9.07 63.2,9.28 v46.94,9.28 | v46.94,11.92 46.74,11.71 v38.2,11.71 | v38.2,15.78 39.22,15.78 39.42,15.98 39.42,16.39 39.62,16.59 U1.3
N$10  (via drill 0.33)
  Top 0.203: v51.87,45.09 v50.6,41.69
  Bottom 0.203: v50.6,41.69 48.97,41.18 48.97,40.16 U$12.7 | v51.87,45.09 51.36,45.24 R9.2
N$13  (via drill 0.33)
  Top 0.203: v67.26,21.72 v67.26,17.4
  Bottom 0.203: v67.26,17.4 66.04,17.4 U5.1 | R13.1 v67.26,21.72
N$14  (via drill 0.33)
  Top 0.203: v53.8,21.16 54.05,6.63 54.46,6.63 LED1.C
  Bottom 0.203: v53.8,21.16 54.25,20.45 R13.2
PB0  (via drill 0.33)
  Top 0.203: v28.65,8.87 v28.65,17.61
  Bottom 0.203: v28.65,17.61 37.19,17.61 38,18.42 U1.8 | v28.65,8.87 26.21,8.87 U$2.7
PB4_8  (via drill 0.33)
  Top 0.203: v46.74,21.67 46.94,21.47 46.94,20.05 47.14,19.84 47.14,14.15 v46.94,13.95
  Bottom 0.203: v46.74,21.67 49.58,21.67 49.58,22.69 49.38,22.89 48.56,22.89 48.36,22.69 45.11,22.69 44.7,23.09 44.09,23.09 43.69,22.69 U1.28 | v46.94,13.95 42.06,13.95 41.86,13.75 41.05,13.75 40.84,13.95 28.65,13.95 28.45,13.75 27.64,13.75 27.43,13.95 26.21,13.95 U$2.3
PB5_9  (via drill 0.33)
  Top 0.203: v47.75,11.31 47.95,11.51 47.95,20.25 47.75,20.45 v47.75,25.53 | v42.88,25.53 42.88,21.87 v42.67,21.67
  Bottom 0.203: v47.75,11.31 41.66,11.31 41.45,11.1 40.23,11.1 40.03,10.9 28.85,10.9 28.25,11.51 26.21,11.51 U$2.5 | v42.88,25.53 v47.75,25.53 | v42.67,21.67 43.28,21.67 43.69,22.08 U1.29
PB6_10  (via drill 0.33)
  Top 0.203: v48.97,22.28 48.97,20.45 48.77,20.25 48.77,10.7 49.58,9.89 v49.58,5.01 | v26.01,5.72 26.01,2.37 SERIAL1.3
  Bottom 0.203: v48.97,22.28 44.5,22.28 44.3,22.08 U1.30 | v49.58,5.01 43.89,5.01 43.69,5.21 26.42,5.21 26.01,5.62 v26.01,5.72
PB7_11  (via drill 0.33)
  Top 0.203: SERIAL1.2 28.45,7.65 29.26,8.46 29.26,9.28 29.06,9.48 29.06,17 29.26,17.2 v29.26,22.28
  Bottom 0.203: v29.26,22.28 29.46,22.08 34.75,22.08 35.15,22.48 35.97,22.48 36.17,22.28 36.17,21.47 36.37,21.26 36.58,21.26 36.78,21.06 U1.12
PC6_5  (via drill 0.33)
  Top 0.203: v49.58,29.7 v49.58,20.25 | v19.3,27.56 v19.3,30.41
  Bottom 0.203: v49.58,20.25 47.14,20.25 45.52,21.87 44.91,21.87 44.7,21.67 U1.31 | v19.3,30.41 20.32,30.41 20.73,30 21.34,30 21.54,29.8 34.54,29.8 34.95,30.21 49.17,30.21 49.58,29.8 v49.58,29.7 | v19.3,27.56 18.09,27.56 17.88,27.36 9.35,27.36 8.74,26.75 6.91,26.75 SP1.P$1
PD2  (via drill 0.33)
  Top 0.203: v35.76,26.95 35.76,28.99 v35.56,29.19 | v16.66,29.39 16.46,29.6 16.46,34.68 v16.66,34.88
  Bottom 0.203: v35.76,26.95 35.97,26.75 39.01,26.75 39.01,24.11 39.42,24.11 39.83,23.7 U1.20 | v35.56,29.19 35.36,28.99 21.13,28.99 20.93,29.19 16.87,29.19 v16.66,29.39 | v16.66,34.88 7.32,34.88 SERIAL.3
PD3  (via drill 0.33)
  Top 0.203: v19.91,29.8 20.12,30 20.12,37.32 v19.91,37.52
  Bottom 0.203: v19.91,29.8 20.12,29.6 21.13,29.6 21.34,29.39 34.75,29.39 35.15,29.8 43.48,29.8 43.48,26.75 43.28,26.55 39.42,26.55 39.42,24.72 40.03,24.11 U1.21 | v19.91,37.52 7.52,37.52 SERIAL.2
PD6_12  (via drill 0.33)
  Top 0.203: v64.21,33.46 64.21,32.03 U3.B2A | v53.85,33.86 v53.34,24.92
  Bottom 0.203: 64.41,33.66 66.24,33.66 66.45,33.86 66.45,35.69 R6.2 | v53.34,24.92 52.38,23.7 47.75,23.7 47.55,23.91 43.28,23.91 42.88,23.5 U1.26 | v53.85,33.86 57.51,33.86 57.71,34.07 63.6,34.07 64.01,33.66 64.41,33.66 | 64.41,33.66 v64.21,33.46
PD7_6  (via drill 0.33)
  Top 0.203: v39.83,40.72 40.84,44.84 STEP1.3 | v45.52,40.97 45.52,37.72 45.31,37.52 45.31,23.5 v45.52,23.3
  Bottom 0.203: v45.52,40.97 v39.83,40.72 | v45.52,23.3 45.31,23.5 43.69,23.5 43.28,23.09 U1.27
PE6_7  (via drill 0.33)
  Top 0.203: v36.78,15.17 36.78,21.87 36.37,22.28 36.37,24.31 36.58,24.52 36.58,27.36 36.17,27.77 36.17,28.99 37.39,30.21 37.39,32.85 37.59,33.05 37.59,33.46 37.8,33.66 37.8,39.35 37.59,39.55 37.59,42.4 38.41,43.21 38.41,45.04 STEP1.2
  Bottom 0.203: v36.78,15.17 39.62,15.17 40.44,15.98 U1.1
PF0  (via drill 0.33)
  Top 0.203: v66.24,8.06 66.24,4.6 STEP2.2 | v54.66,8.06 54.46,8.26 54.46,16.39 v54.66,16.59
  Bottom 0.203: v54.66,8.06 v66.24,8.06 | v54.66,16.59 54.46,16.79 44.7,16.79 44.3,16.39 43.69,16.39 43.28,16.79 43.08,16.79 42.88,17 U1.41
PF1  (via drill 0.33)
  Top 0.203: v68.94,8.92 68.68,5.62 STEP2.3 | v56.08,18.22 v56.08,8.67
  Bottom 0.203: v68.94,8.92 65.84,8.67 65.63,8.46 56.29,8.46 v56.08,8.67 | v56.08,18.22 55.07,17.2 44.5,17.2 44.09,16.79 43.89,17 43.69,17 43.28,17.4 U1.40
PF4  (via drill 0.33)
  Top 0.203: v46.53,33.05 v46.53,36.71 | v42.27,18.01 42.27,16.18 42.47,15.98 42.47,11.31 42.67,11.1 42.67,10.09 42.88,9.89 43.69,9.89 43.89,10.09 43.89,12.73 44.3,13.14 44.3,18.22 44.5,18.42 44.5,31.02 v44.3,31.22
  Bottom 0.203: v46.53,36.71 47.75,36.71 U$12.2 | v46.53,33.05 46.53,32.03 C10.2 46.53,31.83 46.53,31.22 v44.3,31.22 | v42.27,18.01 42.47,18.22 43.08,18.22 43.48,17.81 U1.39
PF5  (via drill 0.33)
  Top 0.203: v44.91,38.13 v44.91,17.81
  Bottom 0.203: v44.91,17.81 44.3,17.81 43.89,18.22 U1.38 | C14.2 43.28,38.13 v44.91,38.13 45.11,38.13 45.72,37.52 47.75,37.52 U$12.3
PF6  (via drill 0.33)
  Top 0.203: v67.26,9.68 67.26,13.95 U3.H2 | v43.28,10.49 43.08,10.7 43.08,11.31 42.88,11.51 42.88,18.83 v43.28,19.23
  Bottom 0.203: v67.26,9.68 47.55,9.68 46.74,10.49 v43.28,10.49 | v43.28,19.23 43.69,18.83 43.89,18.83 44.09,18.62 U1.37
PF7  (via drill 0.33)
  Top 0.203: v54.41,24.31 v54.66,17.81
  Bottom 0.203: v54.66,17.81 54.46,17.61 46.74,17.61 46.53,17.81 45.92,17.81 45.31,18.42 45.11,18.42 44.7,18.83 U1.36 | v54.41,24.31 57.1,24.31 U3.V2
PROG  (via drill 0.33)
  Top 0.203: v71.78,15.83 v71.53,17.4
  Bottom 0.203: v71.53,17.4 68.68,17.4 U5.5 | v71.78,15.83 73.36,14.56 R12.2
RESET  (via drill 0.33)
  Top 0.203: v9.75,4.2 9.75,1.55 9.35,1.55 U$14.3 | U$14.4 17.88,1.55 19.51,1.55 19.91,1.96 v19.91,4.4 19.91,5.82 20.93,6.84 20.93,21.26 JP5.3 20.93,21.47 20.93,21.67 21.13,21.67 v22.35,22.89
  Bottom 0.203: R5.1 8.53,4.2 v9.75,4.2 16.87,4.2 17.07,4.4 v19.91,4.4 | v22.35,22.89 36.17,22.89 36.58,22.48 36.58,21.87 37.19,21.26 U1.13
SCK  (via drill 0.33)
  Top 0.203: v36.17,20.65 v36.17,18.42 | v23.16,25.18 v23.16,20.91 v23.16,10.09
  Bottom 0.203: v36.17,18.42 37.19,18.42 37.59,18.83 U1.9 | v36.17,20.65 35.97,20.86 23.37,20.86 v23.16,20.91 | v23.16,25.18 21.34,23.91 JP5.2 | v23.16,10.09 19.71,10.09 U$2.11
SCK_3V3  (via drill 0.33)
  Top 0.203: v20.07,42.85 20.32,39.35 20.52,39.15 20.52,28.38 v20.32,28.17 | v16.66,11.51 v16.66,28.17 | v36.78,28.17 36.98,27.97 36.98,24.31 36.78,24.11 36.78,23.09 39.62,23.09 LCD1.9
  Bottom 0.203: v20.07,42.85 20.17,42.35 19.91,41.38 U4.5 | v16.66,28.17 v20.32,28.17 v36.78,28.17 | v16.66,11.51 19.51,11.51 U$2.12
SCL  (via drill 0.33)
  Top 0.203: v32.31,24.31 32.51,24.11 32.51,20.45 32.11,20.05 v32.11,19.44 | v17.88,18.83 18.09,18.62 18.09,11.1 v17.88,10.9
  Bottom 0.203: v32.31,24.31 33.93,24.31 34.14,24.11 37.8,24.11 38.61,23.3 38.81,23.3 39.01,23.09 U1.18 | v32.11,19.44 31.9,19.64 24.99,19.64 24.38,19.03 18.09,19.03 v17.88,18.83 | v17.88,10.9 9.75,10.9 9.35,11.31 I2C.2
SDA  (via drill 0.33)
  Top 0.203: v32.92,19.84 v32.92,26.34 | v17.27,19.44 17.07,19.23 17.07,14.15 v17.27,13.95
  Bottom 0.203: v32.92,26.34 38.61,26.34 38.61,24.31 38.41,24.11 38.81,23.7 39.01,23.7 39.22,23.5 U1.19 | v32.92,19.84 32.72,20.05 24.79,20.05 24.18,19.44 v17.27,19.44 | v17.27,13.95 7.92,13.95 I2C.3
UCAP  (via drill 0.33)
  Top 0.203: v62.18,18.01 62.38,18.22 62.38,25.33 v62.18,25.53 | v43.89,24.52 43.89,24.11 44.09,23.91 44.09,20.65 43.89,20.45 42.06,20.45 v42.06,19.44
  Bottom 0.203: v62.18,18.01 62.38,18.01 62.38,17 C7.1 | v62.18,25.53 56.69,25.53 53.95,25.84 52.48,25.58 51.51,24.87 48.21,24.36 47.75,24.31 44.09,24.31 v43.89,24.52 | v42.06,19.44 40.23,19.44 39.83,19.03 39.62,19.03 39.42,18.83 39.42,18.62 38.81,18.01 U1.6
VBUS  (via drill 0.33)
  Top 0.203: v68.83,26.14 v69.6,29.19
  Bottom 0.203: v69.6,29.19 68.07,29.19 F1.1 | v68.83,26.14 71.12,26.14 71.32,25.94 72.14,25.94 X1.VBUS
VCC  (via drill 0.33)
  Top 0.203: v68.89,20.45 68.99,21.87 v67.46,27.31 | v54.46,4.81 54.46,3.18 LED1.A 54.66,3.18 55.88,3.18 56.08,3.38 v56.08,7.45 | v43.28,4.6 43.28,8.26 U$18.1 | v40.44,17.4 40.64,17.2 40.64,15.17 40.44,14.97 40.18,10.7 39.98,9.48 v41.25,3.84 | v63.8,27.77 63.8,24.31 63.6,24.11 63.6,12.93 63.8,12.73 63.8,9.68 64.01,9.48 v64.01,7.45
  Bottom 0.203: 65.02,27.77 v63.8,27.77 61.57,27.77 C20.1 | 65.02,27.77 65.23,27.97 65.23,29.19 F1.2 | v68.89,20.45 68.68,19.44 U5.4 | v67.46,27.31 65.43,27.56 65.23,27.77 65.02,27.77 | 41.05,17.4 41.66,18.01 41.66,18.42 42.06,18.83 42.47,18.83 42.67,19.03 42.67,20.05 41.66,20.05 41.45,19.84 40.03,19.84 39.62,19.44 39.42,19.44 39.01,19.03 39.01,18.83 38.41,18.22 U1.7 | 41.05,17.4 40.23,16.59 U1.2 | v54.46,4.81 54.25,4.6 52.43,4.6 52.22,4.4 48.97,4.4 48.77,4.6 43.69,4.6 | v43.28,4.6 43.69,4.6 | v40.44,17.4 41.05,17.4 | v41.25,3.84 41.45,4.04 43.23,4.55 43.69,4.6 | v64.01,7.45 63.8,7.65 56.29,7.65 v56.08,7.45

### Text on the board
tPlace: Micro SD | LEONARDO CLONE | www.LucidTronix.com/tutorials/48 | 5V | GND | LEONARDO CLONE | 7 | 6 | Serial1 | TFT LCD SD JOY BOT | 2 | Charging | 5V | I C | A4 | A5 | 10 | 11 | GND | USB | GND | RESET | 5V | Battery
bPlace: MicroSD | 10k | GND | 5V | 7 | 6 | 3300pf | MMA | 0.1uf | 6331 | AccelerometerX->3 | GND | 18pf | AccelerometerY->2 | PD3 | 18pf | PD2 | 1 | 10k | 16MHz | 12 | 0.1uf | 5V | Piezo PWM 5 | 3300pf | fuse | 5V | 4.7uf | USB | PIEZO | 22 | A0 | 22 | 32u4 | Mini | 300 | RESET | mcp | 4.7uf | 1uf | 1 | Atmega | 73831 | 5V | CD4050 | 1 | - | SDA | 3v3 | 0.1uf | 0.1uf | + | 2k | SCL | A1 | vreg | JoyX->1 | A4 | 5V | GND | 10uf | JoyY->0 | A5 | JoyBtn->12 | 10k | 0.1uf | 5V | 10 | 11 | GND | JST | GND | Battery | 10uf | Remove with pliers!